# EAGLE schematic UniversalTx (EAGLE 6.5.0)
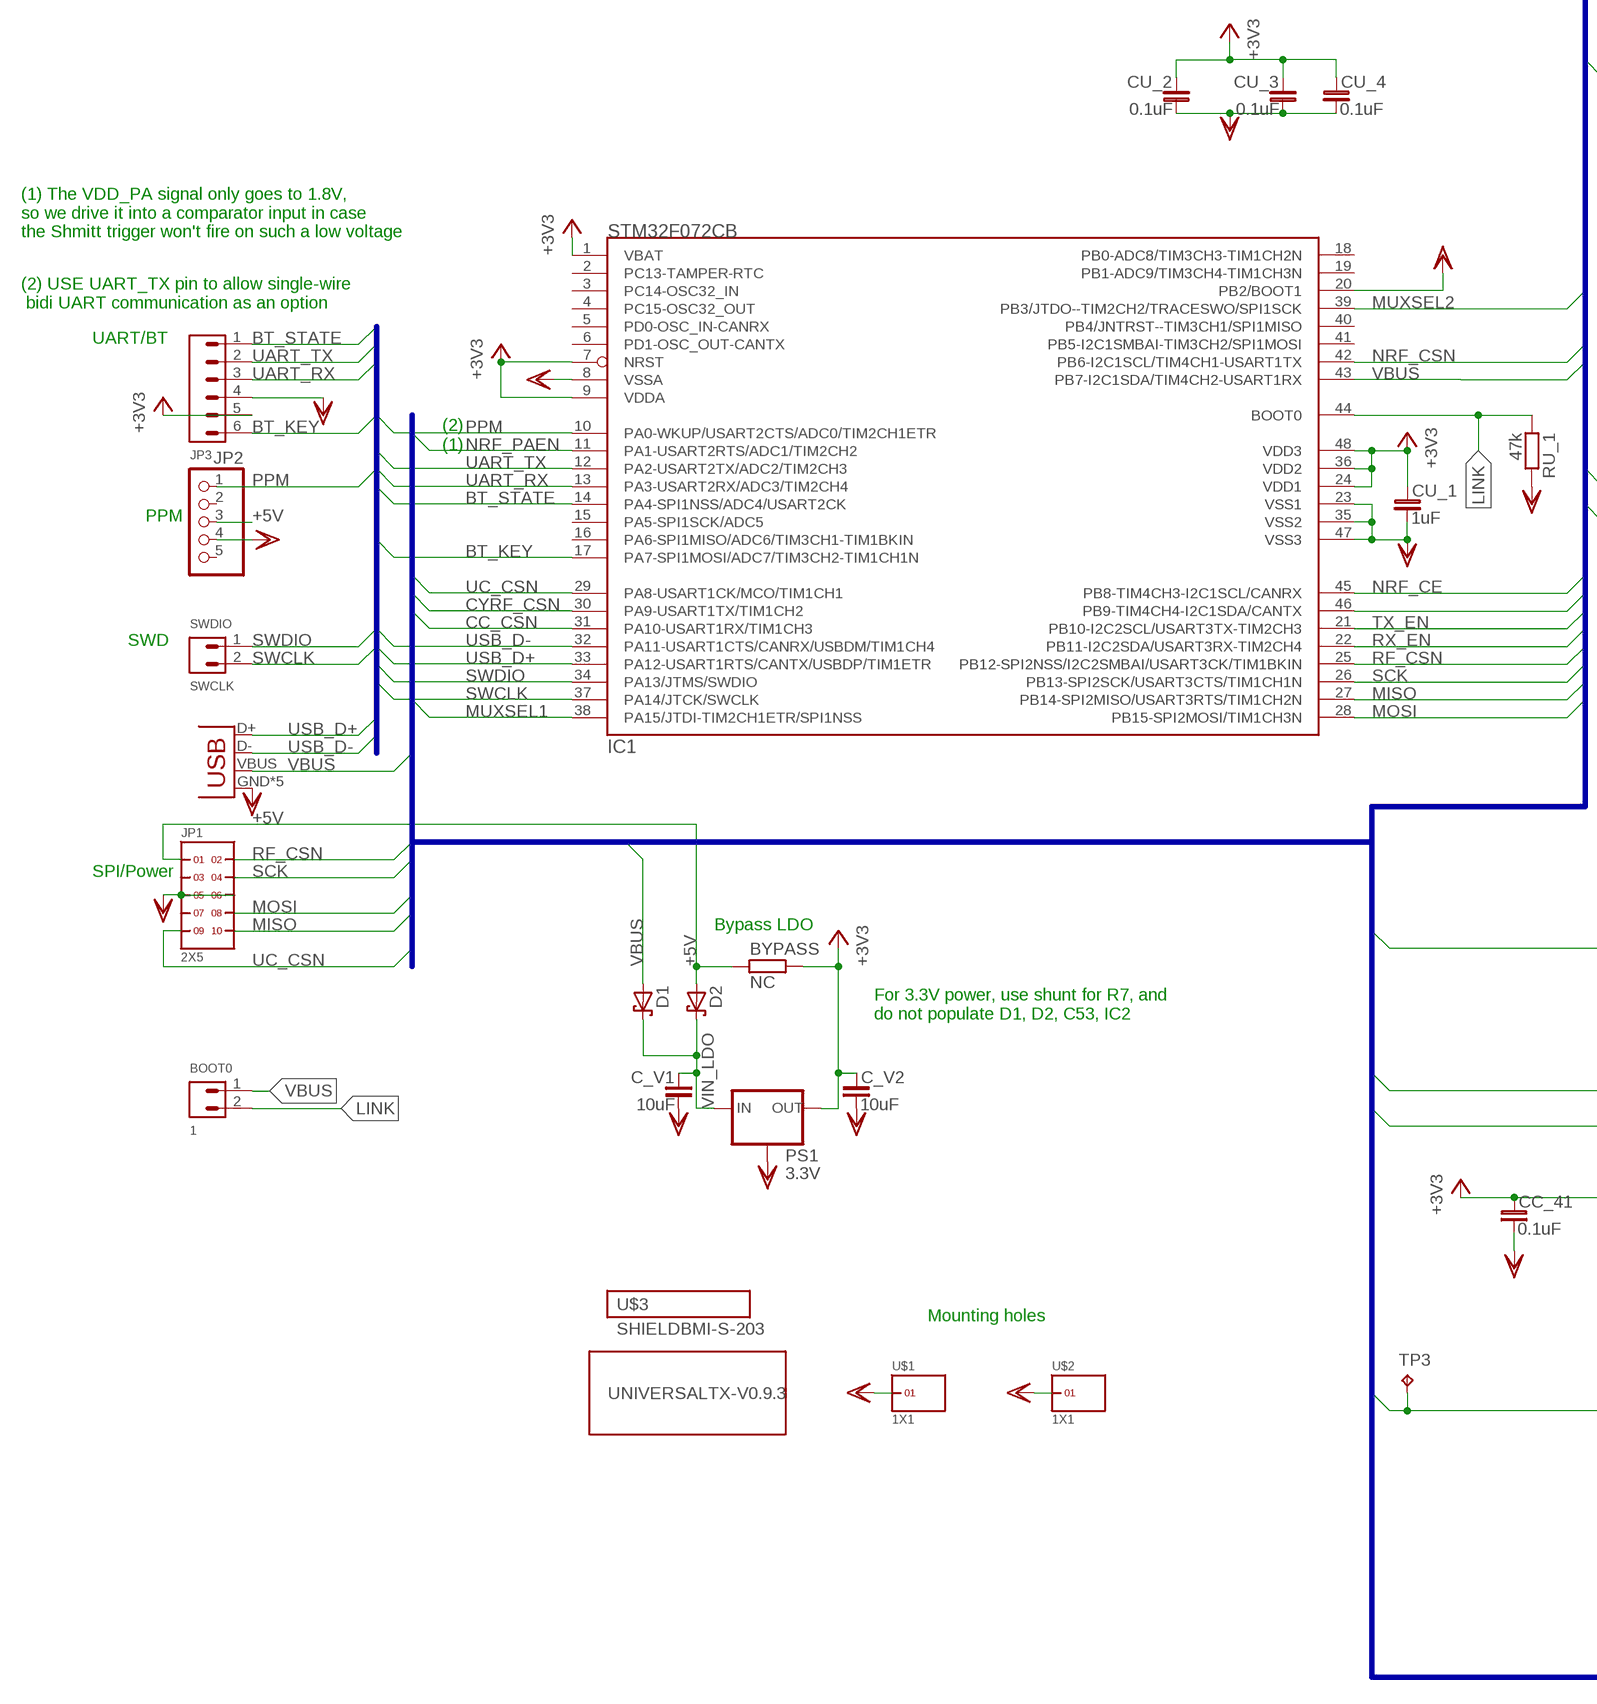
[diagram p0: schematic, sheet 1, part 1 of 2]
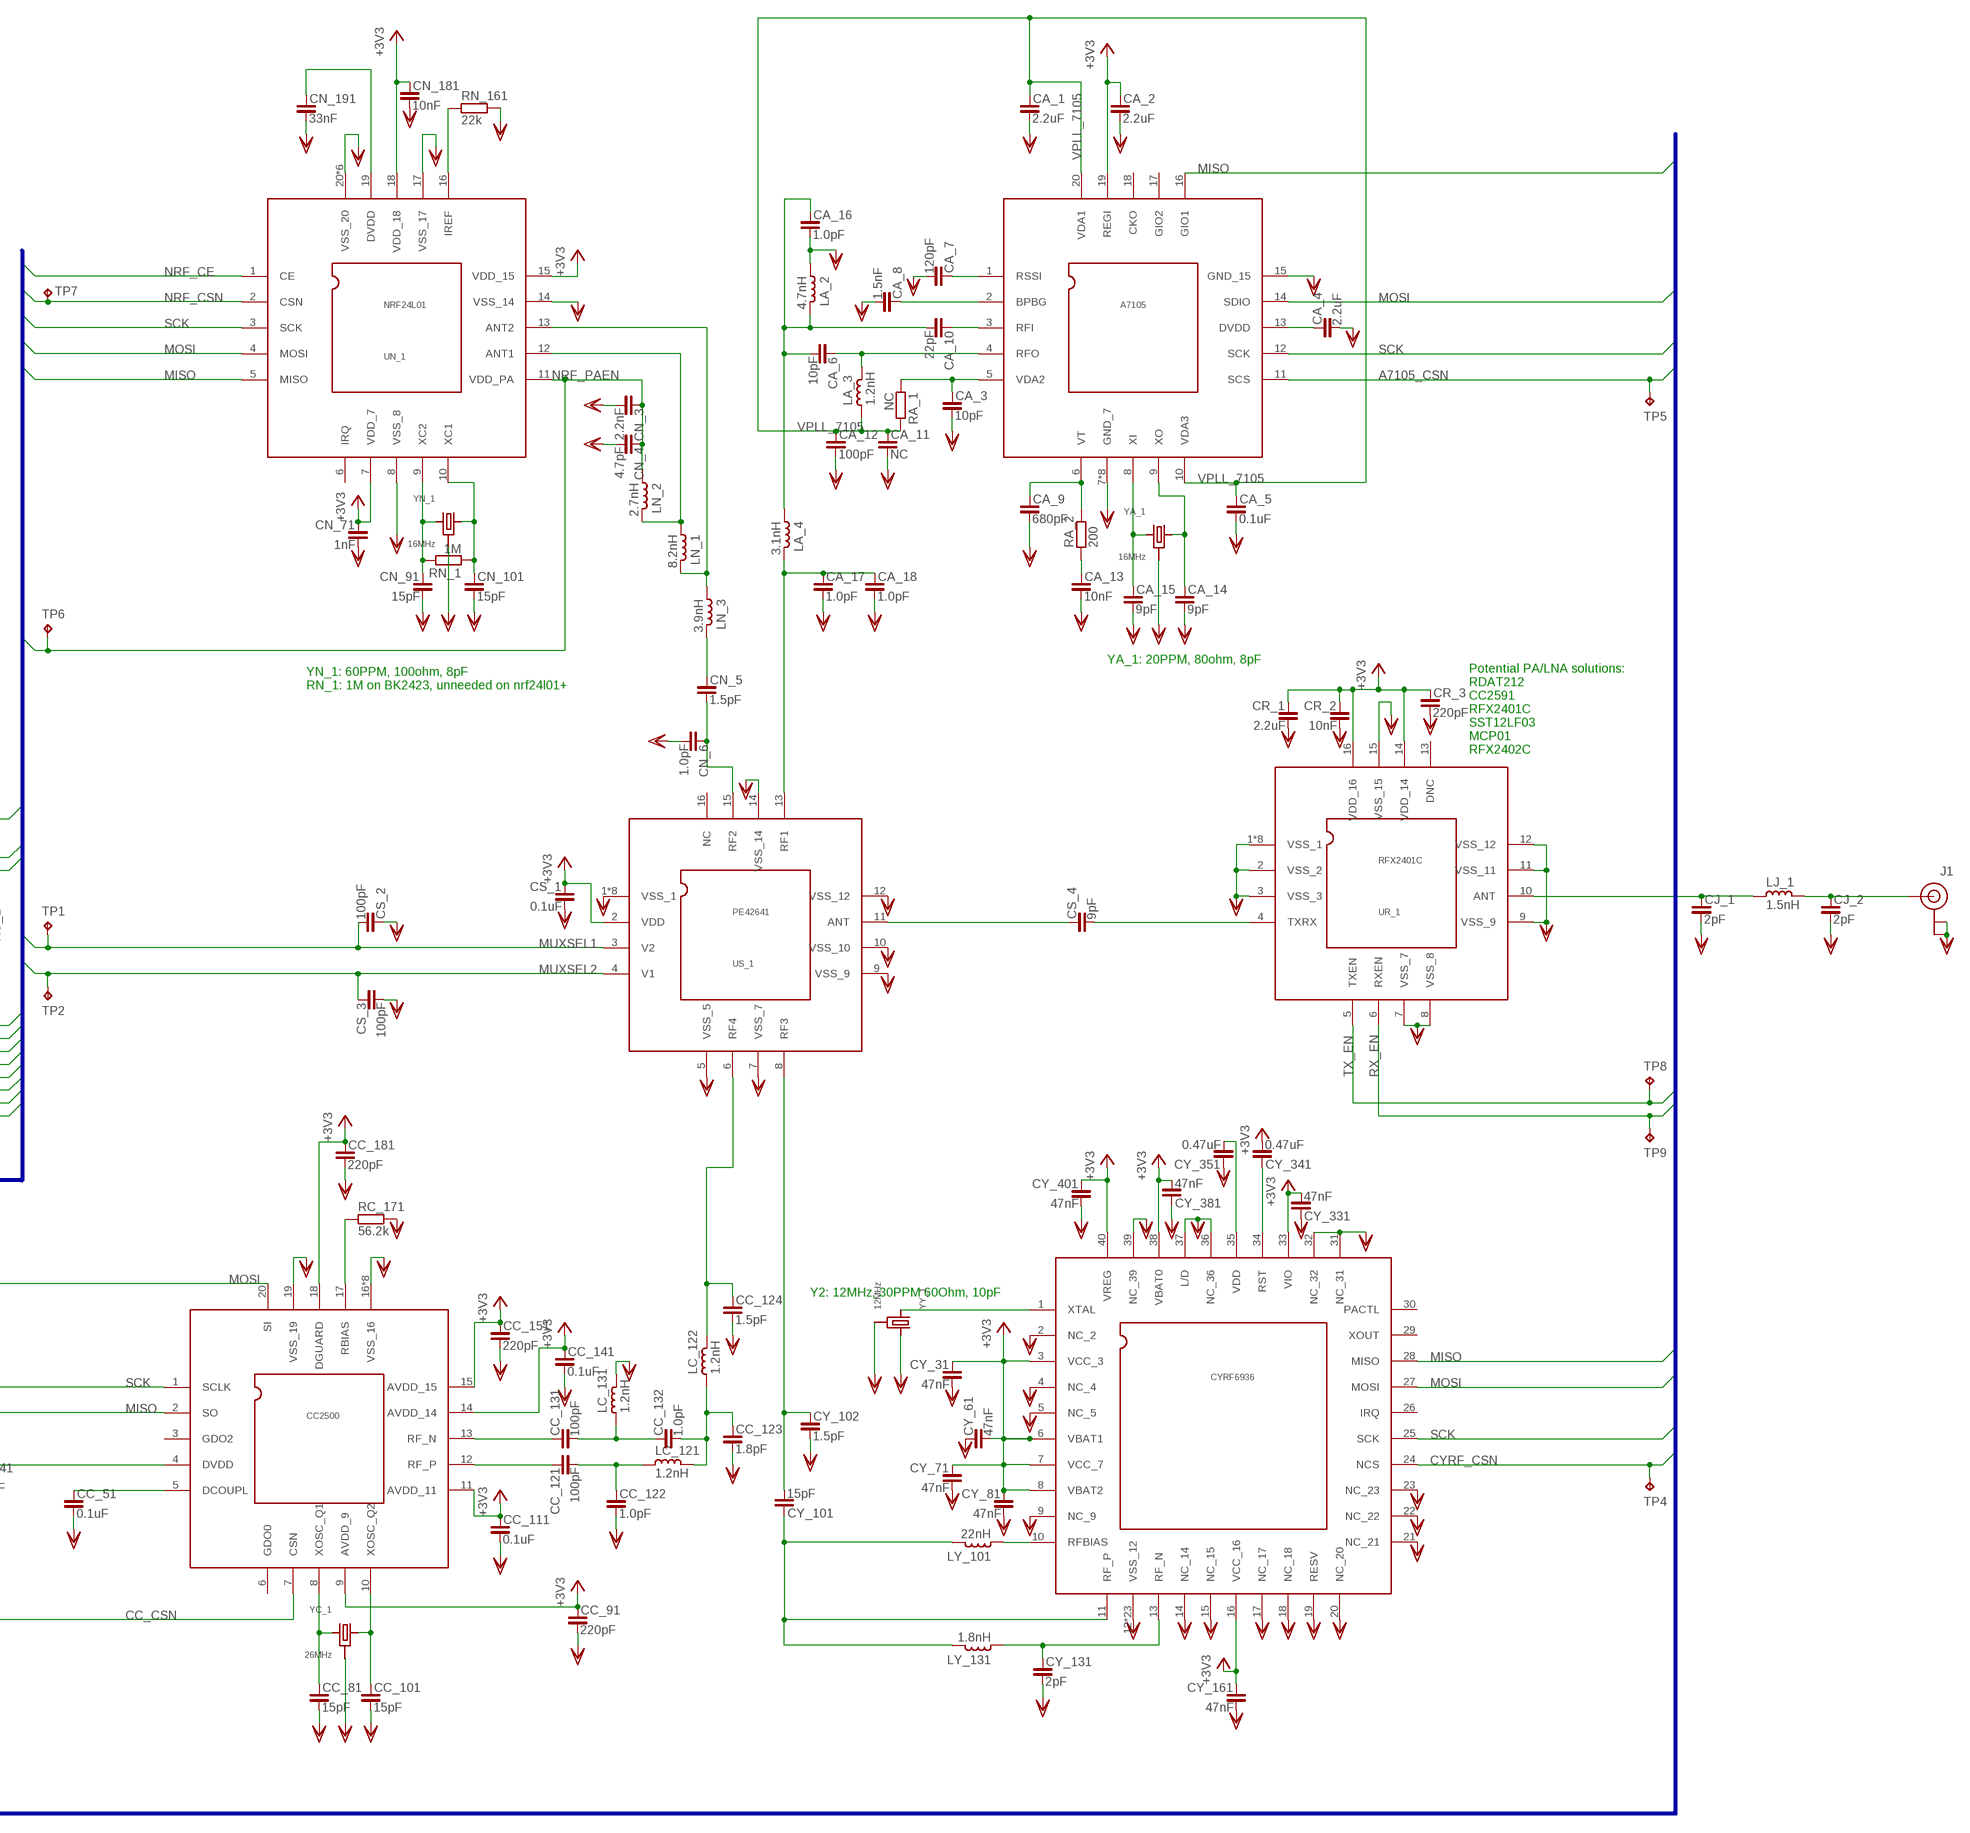
[diagram p1: schematic, sheet 1, part 2 of 2]

## Parts
1  BOOT0  PH1X2-05  [PH005-1-2]
BYPASS  NC  R_0805  [R0805]
C_V1  10uF  C_0805  [C0805]
C_V2  10uF  C_0805  [C0805]
CA_1  2.2uF  C_0402  [C0402]
CA_2  2.2uF  C_0402  [C0402]
CA_3  10pF  C_0402  [C0402]
CA_4  2.2uF  C_0402  [C0402]
CA_5  0.1uF  C_0402  [C0402]
CA_6  10pF  C_0402  [C0402]
CA_7  120pF  C_0402  [C0402]
CA_8  1.5nF  C_0402  [C0402]
CA_9  680pF  C_0402  [C0402]
CA_10  22pF  C_0402  [C0402]
CA_11  NC  C_0402  [C0402]
CA_12  100pF  C_0402  [C0402]
CA_13  10nF  C_0402  [C0402]
CA_14  9pF  C_0402  [C0402]
CA_15  9pF  C_0402  [C0402]
CA_16  1.0pF  C_0402  [C0402]
CA_17  1.0pF  C_0402  [C0402]
CA_18  1.0pF  C_0402  [C0402]
CC_41  0.1uF  C_0402  [C0402]
CC_51  0.1uF  C_0402  [C0402]
CC_81  15pF  C_0402  [C0402]
CC_91  220pF  C_0402  [C0402]
CC_101  15pF  C_0402  [C0402]
CC_111  0.1uF  C_0402  [C0402]
CC_121  100pF  C_0402  [C0402]
CC_122  1.0pF  C_0402  [C0402]
CC_123  1.8pF  C_0402  [C0402]
CC_124  1.5pF  C_0402  [C0402]
CC_131  100pF  C_0402  [C0402]
CC_132  1.0pF  C_0402  [C0402]
CC_141  0.1uF  C_0402  [C0402]
CC_151  220pF  C_0402  [C0402]
CC_181  220pF  C_0402  [C0402]
CJ_1  2pF  C_0402  [C0402]
CJ_2  2pF  C_0402  [C0402]
CN_3  2.2nF  C_0402  [C0402]
CN_4  4.7pF  C_0402  [C0402]
CN_5  1.5pF  C_0402  [C0402]
CN_6  1.0pF  C_0402  [C0402]
CN_71  1nF  C_0402  [C0402]
CN_91  15pF  C_0402  [C0402]
CN_101  15pF  C_0402  [C0402]
CN_181  10nF  C_0402  [C0402]
CN_191  33nF  C_0402  [C0402]
CR_1  2.2uF  C_0402  [C0402]
CR_2  10nF  C_0402  [C0402]
CR_3  220pF  C_0402  [C0402]
CS_1  0.1uF  C_0402  [C0402]
CS_2  100pF  C_0402  [C0402]
CS_3  100pF  C_0402  [C0402]
CS_4  9pF  C_0402  [C0402]
CU_1  1uF  C_0402  [C0402]
CU_2  0.1uF  C_0402  [C0402]
CU_3  0.1uF  C_0402  [C0402]
CU_4  0.1uF  C_0402  [C0402]
CY_31  47nF  C_0402  [C0402]
CY_61  47nF  C_0402  [C0402]
CY_71  47nF  C_0402  [C0402]
CY_81  47nF  C_0402  [C0402]
CY_101  15pF  C_0402  [C0402]
CY_102  1.5pF  C_0402  [C0402]
CY_131  2pF  C_0402  [C0402]
CY_161  47nF  C_0402  [C0402]
CY_331  47nF  C_0402  [C0402]
CY_341  0.47uF  C_0402  [C0402]
CY_351  0.47uF  C_0402  [C0402]
CY_381  47nF  C_0402  [C0402]
CY_401  47nF  C_0402  [C0402]
D1  LSM115J  [DO214BA-DIODE]
D2  LSM115J  [DO214BA-DIODE]
IC1  STM32F072CB  STM32-M-48  [LQFP48]
J1  U.FL  [U.FL]
JP1  2X5  [2X5]
JP2  PINHD-1X05_2.54-S  [1X05-S]
JP3  PH1X6-05  [PH005-1-6]
JP6  USBSMD  [USB-MINIB]
LA_2  4.7nH  L_0402  [L0402]
LA_3  1.2nH  L_0402  [L0402]
LA_4  3.1nH  L_0402  [L0402]
LC_121  1.2nH  L_0402  [L0402]
LC_122  1.2nH  L_0402  [L0402]
LC_131  1.2nH  L_0402  [L0402]
LJ_1  1.5nH  L_0402  [L0402]
LN_1  8.2nH  L_0402  [L0402]
LN_2  2.7nH  L_0402  [L0402]
LN_3  3.9nH  L_0402  [L0402]
LY_101  22nH  L_0402  [L0402]
LY_131  1.8nH  L_0402  [L0402]
PS1  3.3V  LD1117SOT223  [SOT223]
RA_1  NC  R_0402  [R0402]
RA_2  200  R_0402  [R0402]
RC_171  56.2k  R_0402  [R0402]
RN_1  1M  R_0402  [R0402]
RN_161  22k  R_0402  [R0402]
RU_1  47k  R_0402  [R0402]
SWCLK  SWDIO  PH1X2-05  [PH005-1-2]
TP1  TPTP09R  [TP09R]
TP2  TPTP09R  [TP09R]
TP3  TPB1,27  [B1,27]
TP4  TPTP09R  [TP09R]
TP5  TPTP09R  [TP09R]
TP6  TPTP09R  [TP09R]
TP7  TPTP09R  [TP09R]
TP8  TPTP09R  [TP09R]
TP9  TPTP09R  [TP09R]
U$1  1X1  [1X1]
U$2  1X1  [1X1]
U$3  SHIELDBMI-S-203  [BMI-S-203-F]
UA_1  A7105  [A7105]
UC_1  CC2500  [CC2500]
UN_1  NRF24L01  [QFN20-4X4-NRF]
UNIVERSALTX-V0.9.3  LITTLE-GUYLITTLE-GUY-X  [LITTLE-GUY-X]
UR_1  RFX2401C  [QFN16-3X3-PAD]
US_1  PE42641  [QFN16-3X3-PAD]
UY_1  CYRF6936  [CYRF6936]
YA_1  16MHz  CRYSTAL.3.2X2.5MM  [3.2X2.5MM]
YC_1  26MHz  CRYSTAL.3.2X2.5MM  [3.2X2.5MM]
YN_1  16MHz  CRYSTAL.3.2X2.5MM  [3.2X2.5MM]
YY_1  12MHz  CRYSTAL.5X3.2MM  [5X3.2MM]

## Nets
+3V3: BYPASS.2 C_V2.1 CA_2.1 CC_41.1 CC_91.1 CC_111.1 CC_141.1 CC_151.1 CC_181.1 CN_71.1 CN_181.1 CR_1.1 CR_2.1 CR_3.1 CS_1.1 CU_1.1 CU_2.1 CU_3.1 CU_4.1 CY_31.1 CY_61.2 CY_71.1 CY_81.1 CY_161.1 CY_331.2 CY_341.2 CY_381.2 CY_401.1 IC1.1(VBAT) IC1.7(NRST) IC1.9(VDDA) IC1.24(VDD1) IC1.36(VDD2) IC1.48(VDD3) JP3.5 PS1.2(OUT) PS1.4(OUT) UA_1.19(REGI) UC_1.4(DVDD) UC_1.9(AVDD_9) UC_1.11(AVDD_11) UC_1.14(AVDD_14) UC_1.15(AVDD_15) UC_1.18(DGUARD) UN_1.7(VDD_7) UN_1.15(VDD_15) UN_1.18(VDD_18) UR_1.14(VDD_14) UR_1.16(VDD_16) US_1.2(VDD) UY_1.3(VCC_3) UY_1.6(VBAT1) UY_1.7(VCC_7) UY_1.8(VBAT2) UY_1.16(VCC_16) UY_1.33(VIO) UY_1.38(VBAT0) UY_1.40(VREG)
+5V: BYPASS.1 D2.A JP1.1 JP2.3
A7105_CSN: IC1.46(PB9-TIM4CH4-I2C1SDA/CANTX) TP5.TP UA_1.11(SCS)
BT_KEY: IC1.17(PA7-SPI1MOSI/ADC7/TIM3CH2-TIM1CH1N) JP3.6
BT_STATE: IC1.14(PA4-SPI1NSS/ADC4/USART2CK) JP3.1
CC_CSN: IC1.31(PA10-USART1RX/TIM1CH3) TP3.TP UC_1.7(CSN)
CYRF_CSN: IC1.30(PA9-USART1TX/TIM1CH2) TP4.TP UY_1.24(NCS)
LINK: 1.2 IC1.44(BOOT0) RU_1.1
MISO: IC1.27(PB14-SPI2MISO/USART3RTS/TIM1CH2N) JP1.10 UA_1.16(GIO1) UC_1.2(SO) UN_1.5(MISO) UY_1.28(MISO)
MOSI: IC1.28(PB15-SPI2MOSI/TIM1CH3N) JP1.8 UA_1.14(SDIO) UC_1.20(SI) UN_1.4(MOSI) UY_1.27(MOSI)
MUXSEL1: CS_2.2 IC1.38(PA15/JTDI-TIM2CH1ETR/SPI1NSS) TP1.TP US_1.3(V2)
MUXSEL2: CS_3.1 IC1.39(PB3/JTDO--TIM2CH2/TRACESWO/SPI1SCK) TP2.TP US_1.4(V1)
N$1: CN_101.1 RN_1.1 UN_1.10(XC1) YN_1.3
N$2: CN_91.1 RN_1.2 UN_1.9(XC2) YN_1.1
N$3: CN_191.1 UN_1.19(DVDD)
N$4: CA_9.1 RA_2.2 UA_1.6(VT)
N$5: LN_1.1 LN_3.2 UN_1.13(ANT2)
N$7: CJ_2.1 J1.P$3(SIGNAL) LJ_1.1
N$8: CN_5.1 LN_3.1
N$9: CN_5.2 CN_6.1 US_1.15(RF2)
N$10: RN_161.1 UN_1.16(IREF)
N$11: CA_13.1 RA_2.1
N$12: CA_14.1 UA_1.9(XO) YA_1.3
N$14: CC_131.1 UC_1.13(RF_N)
N$15: LN_1.2 LN_2.1 UN_1.12(ANT1)
N$16: CC_121.1 UC_1.12(RF_P)
N$17: CA_15.1 UA_1.8(XI) YA_1.1
N$18: CA_4.1 UA_1.13(DVDD)
N$24: CC_123.1 CC_132.2 LC_121.1 LC_122.2
N$25: CA_17.1 CA_18.1 LA_4.1 US_1.13(RF1)
N$26: CA_7.1 UA_1.1(RSSI)
N$27: CA_8.1 UA_1.2(BPBG)
N$28: CA_10.1 UA_1.3(RFI)
N$29: CA_6.1 LA_3.1 UA_1.4(RFO)
N$30: CA_3.1 RA_1.1 UA_1.5(VDA2)
N$31: CJ_1.1 LJ_1.2 UR_1.10(ANT)
N$32: CC_51.1 UC_1.5(DCOUPL)
N$33: CY_351.2 UY_1.35(VDD)
N$34: CS_4.1 US_1.11(ANT)
N$35: CS_4.2 UR_1.4(TXRX)
N$37: RC_171.1 UC_1.17(RBIAS)
N$38: CC_101.1 UC_1.10(XOSC_Q2) YC_1.3
N$39: CC_81.1 UC_1.8(XOSC_Q1) YC_1.1
N$40: CC_121.2 CC_122.1 LC_121.2
N$41: CC_131.2 CC_132.1 LC_131.2
N$43: CY_341.1 UY_1.34(RST)
N$44: UY_1.1(XTAL) YY_1.1
N$45: LY_101.2 UY_1.10(RFBIAS)
N$46: CY_101.1 LY_101.1 LY_131.1 UY_1.11(RF_P)
N$47: CY_131.1 LY_131.2 UY_1.13(RF_N)
N$48: CA_6.2 CA_10.2 CA_16.1 LA_2.1 LA_4.2
N$49: CY_101.2 CY_102.1 US_1.8(RF3)
N$50: CC_124.1 LC_122.1 US_1.6(RF4)
NRF_CE: IC1.45(PB8-TIM4CH3-I2C1SCL/CANRX) UN_1.1(CE)
NRF_CSN: IC1.42(PB6-I2C1SCL/TIM4CH1-USART1TX) TP7.TP UN_1.2(CSN)
NRF_PAEN: CN_3.1 CN_4.1 IC1.11(PA1-USART2RTS/ADC1/TIM2CH2) LN_2.2 TP6.TP UN_1.11(VDD_PA)
PPM: IC1.10(PA0-WKUP/USART2CTS/ADC0/TIM2CH1ETR) JP2.1
RF_CSN: IC1.25(PB12-SPI2NSS/I2C2SMBAI/USART3CK/TIM1BKIN) JP1.2
RX_EN: IC1.22(PB11-I2C2SDA/USART3RX-TIM2CH4) TP9.TP UR_1.6(RXEN)
SCK: IC1.26(PB13-SPI2SCK/USART3CTS/TIM1CH1N) JP1.4 UA_1.12(SCK) UC_1.1(SCLK) UN_1.3(SCK) UY_1.25(SCK)
SWCLK: IC1.37(PA14/JTCK/SWCLK) SWCLK.2
SWDIO: IC1.34(PA13/JTMS/SWDIO) SWCLK.1
TX_EN: IC1.21(PB10-I2C2SCL/USART3TX-TIM2CH3) TP8.TP UR_1.5(TXEN)
UART_RX: IC1.13(PA3-USART2RX/ADC3/TIM2CH4) JP3.3
UART_TX: IC1.12(PA2-USART2TX/ADC2/TIM2CH3) JP3.2
UC_CSN: IC1.29(PA8-USART1CK/MCO/TIM1CH1) JP1.9
USB_D+: IC1.33(PA12-USART1RTS/CANTX/USBDP/TIM1ETR) JP6.D+
USB_D-: IC1.32(PA11-USART1CTS/CANRX/USBDM/TIM1CH4) JP6.D-
VBUS: 1.1 D1.A IC1.43(PB7-I2C1SDA/TIM4CH2-USART1RX) JP6.VBUS
VIN_LDO: C_V1.1 D1.C D2.C PS1.3(IN)
VPLL_7105: CA_1.1 CA_5.1 CA_11.1 CA_12.1 LA_3.2 RA_1.2 UA_1.10(VDA3) UA_1.20(VDA1)
VSS: C_V1.2 C_V2.2 CA_1.2 CA_2.2 CA_3.2 CA_4.2 CA_5.2 CA_7.2 CA_8.2 CA_9.2 CA_11.2 CA_12.2 CA_13.2 CA_14.2 CA_15.2 CA_16.2 CA_17.2 CA_18.2 CC_41.2 CC_51.2 CC_81.2 CC_91.2 CC_101.2 CC_111.2 CC_122.2 CC_123.2 CC_124.2 CC_141.2 CC_151.2 CC_181.2 CJ_1.2 CJ_2.2 CN_3.2 CN_4.2 CN_6.2 CN_71.2 CN_91.2 CN_101.2 CN_181.2 CN_191.2 CR_1.2 CR_2.2 CR_3.2 CS_1.2 CS_2.1 CS_3.2 CU_1.2 CU_2.2 CU_3.2 CU_4.2 CY_31.2 CY_61.1 CY_71.2 CY_81.2 CY_102.2 CY_131.2 CY_161.2 CY_331.1 CY_351.1 CY_381.1 CY_401.2 IC1.8(VSSA) IC1.20(PB2/BOOT1) IC1.23(VSS1) IC1.35(VSS2) IC1.47(VSS3) J1.P$1(GND) J1.P$2(GND) JP1.5 JP1.6 JP2.4 JP3.4 JP6.GND JP6.MTN1(GND) JP6.MTN2(GND) JP6.MTN3(GND) JP6.MTN4(GND) LA_2.2 LC_131.1 PS1.1(GND) RC_171.2 RN_161.2 RU_1.2 U$1.2 U$2.2 UA_1.7(GND_7) UA_1.15(GND_15) UA_1.21(GND_7) UA_1.22(GND_7) UA_1.P$1(GND_7) UA_1.P$2(GND_7) UA_1.P$3(GND_7) UA_1.P$4(GND_7) UA_1.P$9(GND_7) UC_1.16(VSS_16) UC_1.19(VSS_19) UC_1.21(VSS_16) UC_1.22(VSS_16) UC_1.P$1(VSS_16) UC_1.P$2(VSS_16) UC_1.P$3(VSS_16) UC_1.P$4(VSS_16) UC_1.P$9(VSS_16) UN_1.8(VSS_8) UN_1.14(VSS_14) UN_1.17(VSS_17) UN_1.20(VSS_20) UN_1.P$1(VSS_20) UN_1.P$5(VSS_20) UN_1.P$6(VSS_20) UN_1.P$7(VSS_20) UN_1.P$9(VSS_20) UR_1.1(VSS_1) UR_1.2(VSS_2) UR_1.3(VSS_3) UR_1.7(VSS_7) UR_1.8(VSS_8) UR_1.9(VSS_9) UR_1.11(VSS_11) UR_1.12(VSS_12) UR_1.15(VSS_15) UR_1.17(VSS_1) UR_1.18(VSS_1) UR_1.P$1(VSS_1) UR_1.P$2(VSS_1) UR_1.P$3(VSS_1) UR_1.P$4(VSS_1) UR_1.P$5(VSS_1) US_1.1(VSS_1) US_1.5(VSS_5) US_1.7(VSS_7) US_1.9(VSS_9) US_1.10(VSS_10) US_1.12(VSS_12) US_1.14(VSS_14) US_1.17(VSS_1) US_1.18(VSS_1) US_1.P$1(VSS_1) US_1.P$2(VSS_1) US_1.P$3(VSS_1) US_1.P$4(VSS_1) US_1.P$5(VSS_1) UY_1.2(NC_2) UY_1.4(NC_4) UY_1.5(NC_5) UY_1.9(NC_9) UY_1.12(VSS_12) UY_1.14(NC_14) UY_1.15(NC_15) UY_1.17(NC_17) UY_1.18(NC_18) UY_1.19(RESV) UY_1.20(NC_20) UY_1.21(NC_21) UY_1.22(NC_22) UY_1.23(NC_23) UY_1.31(NC_31) UY_1.32(NC_32) UY_1.36(NC_36) UY_1.37(L/D) UY_1.39(NC_39) UY_1.P$1(VSS_12) UY_1.P$2(VSS_12) UY_1.P$3(VSS_12) UY_1.P$4(VSS_12) UY_1.P$5(VSS_12) UY_1.P$6(VSS_12) UY_1.P$7(VSS_12) UY_1.P$8(VSS_12) UY_1.P$9(VSS_12) UY_1.P$10(VSS_12) UY_1.P$11(VSS_12) UY_1.P$12(VSS_12) UY_1.P$13(VSS_12) UY_1.P$14(VSS_12) UY_1.P$15(VSS_12) UY_1.P$16(VSS_12) UY_1.P$17(VSS_12) UY_1.P$18(VSS_12) UY_1.P$19(VSS_12) UY_1.P$20(VSS_12) UY_1.P$21(VSS_12) UY_1.P$23(VSS_12) YA_1.2(VSS) YA_1.4(VSS) YC_1.2(VSS) YC_1.4(VSS) YN_1.2(VSS) YN_1.4(VSS) YY_1.2(VSS) YY_1.3 YY_1.4(VSS)
Unconnected: IC1.2(PC13-TAMPER-RTC) IC1.3(PC14-OSC32_IN) IC1.4(PC15-OSC32_OUT) IC1.5(PD0-OSC_IN-CANRX) IC1.6(PD1-OSC_OUT-CANTX) IC1.15(PA5-SPI1SCK/ADC5) IC1.16(PA6-SPI1MISO/ADC6/TIM3CH1-TIM1BKIN) IC1.18(PB0-ADC8/TIM3CH3-TIM1CH2N) IC1.19(PB1-ADC9/TIM3CH4-TIM1CH3N) IC1.40(PB4/JNTRST--TIM3CH1/SPI1MISO) IC1.41(PB5-I2C1SMBAI-TIM3CH2/SPI1MOSI) JP1.3 JP1.7 JP2.2 JP2.5 UA_1.17(GIO2) UA_1.18(CKO) UC_1.3(GDO2) UC_1.6(GDO0) UN_1.6(IRQ) UR_1.13(DNC) US_1.16(NC) UY_1.26(IRQ) UY_1.29(XOUT) UY_1.30(PACTL)

## Buses
VBUS,SCK,MOSI,MISO,NRF_CSN,CC_CSN,A7105_CSN,CYRF_CSN,UC_CSN,RF_CSN,NRF_PAEN,MUXSEL1,MUXSEL2,TX_EN,RX_EN,NRF_CE
PPM,UART_TX,UART_RX,BT_KEY,BT_STATE,USB_D+,USB_D-,SWDIO,SWCLK,NRF_PAEN

## Notes on the sheet
- YA_1: 20PPM, 80ohm, 8pF
- YN_1: 60PPM, 100ohm, 8pF
  RN_1: 1M on BK2423, unneeded on nrf24l01+
- Potential PA/LNA solutions:
  RDAT212
  CC2591
  RFX2401C
  SST12LF03
  MCP01
  RFX2402C
- (1) The VDD_PA signal only goes to 1.8V,
  so we drive it into a comparator input in case
  the Shmitt trigger won't fire on such a low voltage
- (2) USE UART_TX pin to allow single-wire
   bidi UART communication as an option
- UART/BT
- (2)
- (1)
- PPM
- SWD
- SPI/Power
- Bypass LDO
- Y2: 12MHz, 30PPM 60Ohm, 10pF
- For 3.3V power, use shunt for R7, and
  do not populate D1, D2, C53, IC2
- Mounting holes

## Library data of the parts
1 SWCLK = UniversalTx:PH1X2
BYPASS RA_1 = rc-master-smd:R_: RESISTOR
C_V1 C_V2 = rc-master-smd:C_: NON-POLARIZED CAP; DIGIKEY#: 490-1709-1-ND; MANF: Murata; MANF#: GRM21BR61A106KE19L; MOUSER#: 81-GRM21BR61A106KE19
CA_1 CA_2 CA_4 CR_1 = rc-master-smd:C_: NON-POLARIZED CAP; DIGIKEY#: 399-7375-1-ND; MANF: Kemet; MANF#: C0402C225M8PACTU; MOUSER#: 80-C0402C225M8P
CA_3 CA_6 = rc-master-smd:C_: NON-POLARIZED CAP; DIGIKEY#: 490-6186-1-ND; MANF: Murata; MANF#: GRM1555C1H100FA01D; MOUSER#: 81-GRM1555C1H100FA1D
CA_5 CC_41 CC_51 CC_111 CC_141 CS_1 CU_2-CU_4 = rc-master-smd:C_: NON-POLARIZED CAP; DIGIKEY#: 490-1318-1-ND; MANF: Murata; MANF#: GRM155R61A104KA01D; MOUSER#: 81-GRM155R61A104KA1D
CA_7 = rc-master-smd:C_: NON-POLARIZED CAP; DIGIKEY#: 490-8183-1-ND; MANF: Murata; MANF#: GRM1555C1H121GA01D; MOUSER#: 81-GRM1555C1H121GA1D
CA_8 = rc-master-smd:C_: NON-POLARIZED CAP; DIGIKEY#: 490-6354-1-ND; MANF: Murata; MANF#: GRM155R71H152KA01J; MOUSER#: 81-GRM155R71H152KA1J
CA_9 = rc-master-smd:C_: NON-POLARIZED CAP; DIGIKEY#: 490-3240-1-ND; MANF: Murata; MANF#: GRM1555C1H681JA01D; MOUSER#: 81-GRM1555C1H681JA1D
CA_10 = rc-master-smd:C_: NON-POLARIZED CAP; DIGIKEY#: 490-8173-1-ND; MANF: Murata; MANF#: GRM1555C1E220GA01D; MOUSER#: 81-GRM1555C1E220GA1D
CA_11 = rc-master-smd:C_: NON-POLARIZED CAP
CA_12 CC_121 CC_131 CS_2 CS_3 = rc-master-smd:C_: NON-POLARIZED CAP; DIGIKEY#: 490-6188-1-ND; MANF: Murata; MANF#: GRM1555C1H101GA01D; MOUSER#: 81-GRM1555C1H101GA1D
CA_13 CN_181 CR_2 = rc-master-smd:C_: NON-POLARIZED CAP; DIGIKEY#: 490-1313-1-ND; MANF: Murata; MANF#: GRM155R71C103KA01D; MOUSER#: 81-GRM155R71C103KA1D
CA_14 CA_15 CS_4 = rc-master-smd:C_: NON-POLARIZED CAP; DIGIKEY#: 490-6257-1-ND; MANF: Murata; MANF#: GRM1555C1H9R0BA01D; MOUSER#: 81-GRM1555C1H9R0BA1D
CA_16-CA_18 CC_122 CC_132 CN_6 = rc-master-smd:C_: NON-POLARIZED CAP; DIGIKEY#: 490-6206-1-ND; MANF: Murata; MANF#: GRM1555C1H1R0BA01D; MOUSER#: 81-GRM1555C1H1R0BA1D
CC_81 CC_101 CN_91 CN_101 CY_101 = rc-master-smd:C_: NON-POLARIZED CAP; DIGIKEY#: 490-6200-1-ND; MANF: Murata; MANF#: GRM1555C1H150FA01D; MOUSER#: 81-GRM1555C1H150FA1D
CC_91 CC_151 CC_181 CR_3 = rc-master-smd:C_: NON-POLARIZED CAP; DIGIKEY#: 490-1293-1-ND; MANF: Murata; MANF#: GRM1555C1H221JA01D; MOUSER#: 81-GRM1555C1H221JA1D
CC_123 = rc-master-smd:C_: NON-POLARIZED CAP; DIGIKEY#: 490-6215-1-ND; MANF: Murata; MANF#: GRM1555C1H1R8BA01D; MOUSER#: 81-GRM1555C1H1R8BA1D
CC_124 CN_5 CY_102 = rc-master-smd:C_: NON-POLARIZED CAP; DIGIKEY#: 490-6212-1-ND; MANF: Murata; MANF#: GRM1555C1H1R5BA01D; MOUSER#: 81-GRM1555C1H1R5BA1D
CJ_1 CJ_2 CY_131 = rc-master-smd:C_: NON-POLARIZED CAP; DIGIKEY#: 490-6226-1-ND; MANF: Murata; MANF#: GRM1555C1H2R0BA01D; MOUSER#: 81-GRM1555C1H2R0BA1D
CN_3 = rc-master-smd:C_: NON-POLARIZED CAP; DIGIKEY#: 490-6358-1-ND; MANF: Murata; MANF#: GRM155R71H222JA01D; MOUSER#: 81-GRM155R71H222JA1D
CN_4 = rc-master-smd:C_: NON-POLARIZED CAP; DIGIKEY#: 490-6244-1-ND; MANF: Murata; MANF#: GRM1555C1H4R7BA01D; MOUSER#: 81-GRM1555C1H4R7BA1D
CN_71 = rc-master-smd:C_: NON-POLARIZED CAP; DIGIKEY#: 490-3244-1-ND; MANF: Murata; MANF#: GRM1555C1H102JA01D; MOUSER#: 81-GRM1555C1H102JA1D
CN_191 = rc-master-smd:C_: NON-POLARIZED CAP; DIGIKEY#: 490-6333-1-ND; MANF: Murata; MANF#: GRM155R71C333KA01J; MOUSER#: 81-GRM155R71C333KA1J
CU_1 = rc-master-smd:C_: NON-POLARIZED CAP; DIGIKEY#: 399-7766-1-ND; MANF: Kemet; MANF#: C0402C105M8PACTU; MOUSER#: 80-C0402C105M8P
CY_31 CY_61 CY_71 CY_81 CY_161 CY_331 CY_381 CY_401 = rc-master-smd:C_: NON-POLARIZED CAP; DIGIKEY#: 490-6473-1-ND; MANF: Murata; MANF#: GRM155R71C473KA01J; MOUSER#: 81-GRM155R71C473KA1J
CY_341 CY_351 = rc-master-smd:C_: NON-POLARIZED CAP; DIGIKEY#: 490-3266-1-ND; MANF: Murata; MANF#: GRM155R60J474KE19D; MOUSER#: 81-GRM155R60J474KE9D
D1 D2 = UniversalTx:LSM115J; DIGIKEY#: LSM115JE3/TR13CT-ND; MANF: Microsemi; MANF#: LSM115JE3/TR13
IC1 = UniversalTx:STM32-M-48: STM32F103 Medium Density 48pins; DIGIKEY#: 497-14645-ND; MANF: STMicroelectronics; MANF#: STM32F072CBT6
J1 = UniversalTx:U.FL: SMD antenna connector- WRL-09144; DIGIKEY#: WM5587CT-ND; MANF: Molex; MANF#: 0734120110; PROD_ID: CONN-09193
JP1 = UniversalTx:2X5; DIGIKEY#: 952-1320-ND; MANF: Harwin; MANF#: M22-2520505
JP2 = UniversalTx:PINHD-1X05: PIN HEADER; DIGIKEY#: S7038-ND; MANF: Sullins; MANF#: PPPC051LFBN-RC
JP3 = UniversalTx:PH1X6
JP6 = UniversalTx:USB: USB Connectors USB-miniB is fully proven SKU : PRT-00587 USB-MICROB has been used. CONN-09505; DIGIKEY#: 670-1190-1-ND; MANF: JAE; MANF#: DX2R005HN2E700; PROD_ID: CONN-08193
LA_2 = rc-master-smd:L_: INDUCTOR; DIGIKEY#: PCD1906CT-ND; MANF: Panasonic; MANF#: ELJ-RF4N7ZFB; MOUSER#: 667-ELJ-RF4N7ZFB
LA_3 LC_121 LC_122 LC_131 = rc-master-smd:L_: INDUCTOR; DIGIKEY#: PCD1899CT-ND; MANF: Panasonic; MANF#: ELJ-RF1N2ZFB; MOUSER#: 667-ELJ-RF1N2ZFB
LA_4 = rc-master-smd:L_: INDUCTOR; DIGIKEY#: 535-10372-1-ND; MANF: Abracon; MANF#: ATFC-0402-3N1-BT
LJ_1 = rc-master-smd:L_: INDUCTOR; DIGIKEY#: PCD1900CT-ND; MANF: Panasonic; MANF#: ELJ-RF1N5ZFB; MOUSER#: 667-ELJ-RF1N5ZFB
LN_1 = rc-master-smd:L_: INDUCTOR; DIGIKEY#: PCD1909CT-ND; MANF: Panasonic; MANF#: ELJ-RF8N2ZFB; MOUSER#: 667-ELJ-RF8N2ZFB
LN_2 = rc-master-smd:L_: INDUCTOR; DIGIKEY#: PCD1903CT-ND; MANF: Panasonic; MANF#: ELJ-RF2N7ZFB; MOUSER#: 667-ELJ-RF2N7ZFB
LN_3 = rc-master-smd:L_: INDUCTOR; DIGIKEY#: PCD1905CT-ND; MANF: Panasonic; MANF#: ELJ-RF3N9ZFB; MOUSER#: 667-ELJ-RF3N9ZFB
LY_101 = rc-master-smd:L_: INDUCTOR; DIGIKEY#: PCD1914CT-ND; MANF: Panasonic; MANF#: ELJ-RF22NGFB; MOUSER#: 667-ELJ-RF22NGFB
LY_131 = rc-master-smd:L_: INDUCTOR; DIGIKEY#: PCD1901CT-ND; MANF: Panasonic; MANF#: ELJ-RF1N8ZFB; MOUSER#: 667-ELJ-RF1N8ZFB
PS1 = UniversalTx:LD1117: Voltage Regulator LM1117 Standard adjustable voltage regulator but in SMD form. Spark Fun Electronics SKU : COM-00595; DIGIKEY#: 497-1241-1-ND; MANF: STMicroelectronics; MANF#: LD1117S33CTR; MOUSER#: 511-LD1117S33C
RA_2 = rc-master-smd:R_: RESISTOR; DIGIKEY#: P200JCT-ND; MANF: Panasonic; MANF#: ERJ-2GEJ201X; MOUSER#: 667-ERJ-2GEJ201X
RC_171 = rc-master-smd:R_: RESISTOR; DIGIKEY#: P56.2KLCT-ND; MANF: Panasonic; MANF#: ERJ-2RKF5622X; MOUSER#: 667-ERJ-2RKF5622X
RN_1 = rc-master-smd:R_: RESISTOR; DIGIKEY#: P1.0MJCT-ND; MANF: Panasonic; MANF#: ERJ-2GEJ105X; MOUSER#: 667-ERJ-2GEJ105X
RN_161 = rc-master-smd:R_: RESISTOR; DIGIKEY#: P22KJCT-ND; MANF: Panasonic; MANF#: ERJ-2GEJ223X; MOUSER#: 667-ERJ-2GEJ223X
RU_1 = rc-master-smd:R_: RESISTOR; DIGIKEY#: P10KJCT-ND; MANF: Panasonic; MANF#: ERJ-2GEJ103X; MOUSER#: 667-ERJ-2GEJ103X
TP1-TP9 = testpad:TP: Test pad
U$1 U$2 = UniversalTx:1X1
U$3 = UniversalTx:SHIELD
UA_1 = UniversalTx:A7105; MANF: Amiccom
UC_1 = UniversalTx:CC2500; DIGIKEY#: 296-19586-2-ND; MANF: TI; MANF#: CC2500RTKR
UN_1 = UniversalTx:NRF24L01: nRF24L01 Single chip 2.4GHz transceiver from Nordic Semiconductors.; DIGIKEY#: 1490-1033-1-ND; MANF: Nordic; MANF#: NRF24L01P-R7
UNIVERSALTX-V0.9.3 = Deviation-Logos:LITTLE-GUY
UR_1 = UniversalTx:RFX2401C; MANF: RF Axis; MANF#: RFX2401C
US_1 = UniversalTx:PE42641
UY_1 = UniversalTx:CYRF6936; DIGIKEY#: 428-2962-ND; MANF: Cypress; MANF#: CYRF6936-40LTXC
YA_1 YN_1 = UniversalTx:CRYSTAL; DIGIKEY#: SER3628CT-ND; MANF: EPSON; MANF#: TSX-3225 16.0000MF09Z-AC3
YC_1 = UniversalTx:CRYSTAL; DIGIKEY#: 535-10916-1-ND; MANF: ABRACON; MANF#: ABM8G-26.000MHZ-4Y-T3
YY_1 = UniversalTx:CRYSTAL; DIGIKEY#: CTX833CT-ND; MANF: CTS; MANF#: 405C11A12M00000